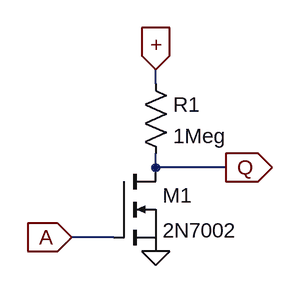
[diagram p0: schematic INV.asc]
INV.asc, the LTspice schematic file:
Version 4
SHEET 1 880 680
WIRE 272 144 272 128
WIRE 272 240 272 224
WIRE 352 240 272 240
WIRE 224 320 176 320
FLAG 272 336 0
FLAG 176 320 A
IOPIN 176 320 In
FLAG 352 240 Q
IOPIN 352 240 Out
FLAG 272 128 +
IOPIN 272 128 In
SYMBOL nmos 224 240 R0
SYMATTR InstName M1
SYMATTR Value 2N7002
SYMBOL res 256 128 R0
SYMATTR InstName R1
SYMATTR Value 1Meg

The netlist it stands for:
* INV.asc
M1 Q A 0 0 2N7002
R1 + Q 1Meg
.model NMOS NMOS
.model PMOS PMOS
.lib standard.mos
.backanno
.end